# Altium schematic sheet Sheet1.SchDoc
size A4; SheetNumber: 1; SheetTotal: 1
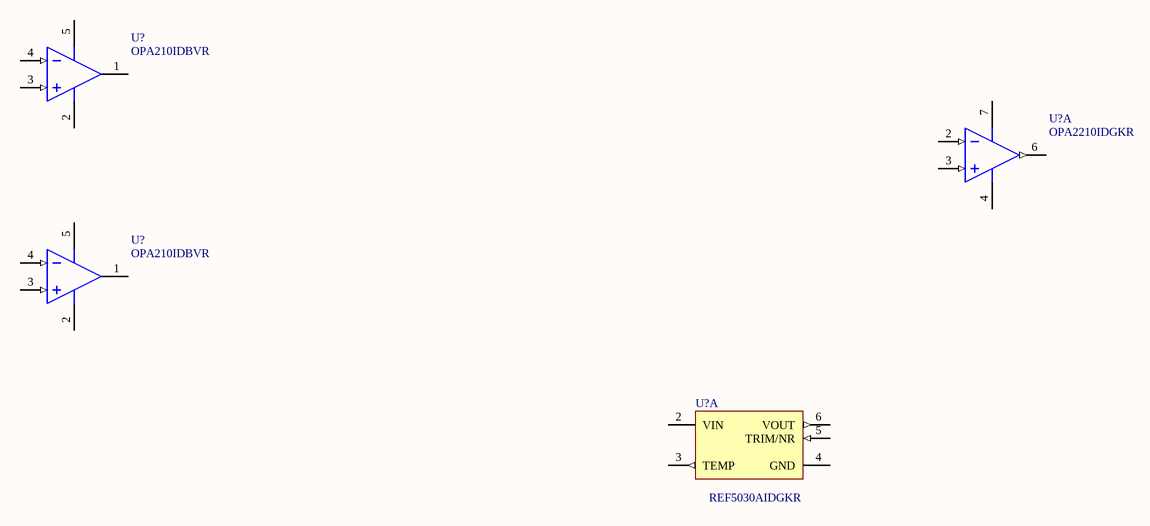
[diagram p0: Sheet1.SchDoc]

## Parts
(Parts that share a designator on the sheet are numbered #1, #2 ... from top to bottom, then left to right.)
U?#1  OPA210IDBVR  [DBV0005A_N]
U?#2  OPA2210IDGKR  [D0008A_N]  (part A of 2)
U?#3  OPA210IDBVR  [DBV0005A_N]
U?#4  REF5030AIDGKR  [DGK0008A_M]  (part A of 2)

## Nets

Not connected (* = marked no-connect by the designer): U?#1 1(OUT) 2(V-) 3(+IN) 4(–IN) 5(V+); U?#2 2(IN_A-) 3(IN_A+) 4(V-) 6(OUT_A) 7(V+); U?#3 1(OUT) 2(V-) 3(+IN) 4(–IN) 5(V+); U?#4 2(VIN) 3(TEMP) 4(GND) 5(TRIM/NR) 6(VOUT)

## Library data of the parts
U?#1 U?#3 = OPA202IDBVR: Precision, Low-Noise, Heavy Capacitive Drive, 36-V Operational Amplifiers, -40 to 105 degC, 5-Pin SOT-23 (DBV), Green (RoHS & no Sb/Br), Tape and Reel; VS Max: 36 V; Channel: 1; VS Min: 4.5 V; Slew Rate: 20 V/us; RoHS: TRUE; ComponentLink2Description: Datasheet; ComponentLink3URL: http://www.ti.com/lit/ml/mpds018l/mpds018l.pdf; Temperature Min: -40 degC; ComponentLink1Description: Manufacturer URL; ComponentLink2URL: http://www.ti.com/lit/ds/symlink/opa192.pdf; Mounting Technology: Surface Mount; PackageVersion: 4073253-4/N, 12/2014; PartNumber: OPA202IDBVR; PackageDescription: 5-Pin Plastic Small Outline, Body 1.6 x 2.9 mm, Pitch 0.95 mm; ComponentLink3Description: Package Specification; Code_JEDEC: MO-178; PackageReference: DBV0005A; Packing: Tape and Reel; ComponentLink1URL: http://www.ti.com/; DatasheetVersion: SBOS620D; Temperature Max: 125 degC
U?#2 = OPA2388IDR: Precision, Zero-Drift, Zero-Crossover, True Rail-to-Rail, Input/Output Operational Amplifiers, 2.5 to 5.5 V, -40 to 105 degC, 8-pin SOIC (D8), Green (RoHS & no Sb/Br); Manufacturer: Texas Instruments; Sub Family: High Supply Voltage Amplifier (>=30V), Low Input Bias Current Amp (<=10pA), Low Noise Amp (<=10nV/rtHz), Low Offset Voltage Amplifier (<=500uV), Precision Amplifier; Total Supply Voltage(Min)(+5V is 5, +/-5V is 10): 4.5; Offset Drift(Typ)(uV/C): 0.35; CMRR(Min)(dB): 126; IIB(Max)(pA): 10; Rating: Catalog; Packing: LARGE T&R; Slew Rate(Typ)(V/us): 20; Number of Channels: 1; Total Supply Voltage(Max)(+5V is 5, +/-5V is 10): 36; Vio (25C)(Max)(mV): 0.12; GBW(Typ)(MHz): 11; Iq per channel(Max)(mA): 2; Code_JEDEC: MS-012; PackageReference: D0008A; PartNumber: OPA2388IDR; PackageDescription: 8-Pin Plastic Small Outline, Body 4.9 x 3.9 mm, Pitch 1.27 mm; PackageVersion: 4040047-3/M, 06/2011; ComponentLink3URL: http://www.ti.com/litv/pdf/msoi002j; ComponentLink2URL: http://www.ti.com/lit/ds/symlink/opa2188.pdf; ComponentLink1Description: Manufacturer URL; DatasheetVersion: SBOS498A; Eco-Plan: Green (RoHS & no Sb/Br); ComponentLink2Description: Datasheet; ComponentLink3Description: Package Specification; ComponentLink1URL: http://www.ti.com/; Mounting Technology: Surface Mount
U?#4 = REF5030AIDGKR: Low Noise, Very Low Drift, Precision Voltage Reference, -40 to 125 degC, 8-pin MSOP (DGK), Green (RoHS & no Sb/Br); Manufacturer: Texas Instruments; Initial Accuracy @ 25/deg C(%): 0.05; Temp Coeff(Max)(ppm/ degree C): 3; SubFamily: Series Voltage Reference; Iq(Max)(uA): 1000; Rating: Catalog; VI(Min)(V): 3.2; Iout/Iz(Max)(mA): 10; VI(Max)(V): 18; Mounting Technology: Surface Mount; PartNumber: REF5030AIDGKR; ComponentLink2Description: Datasheet; DatasheetVersion: SBOS410E; ComponentLink1URL: http://www.ti.com/; ComponentLink3Description: Package Specification; Code_JEDEC: MO-187; ComponentLink1Description: Manufacturer URL; ComponentLink2URL: http://www.ti.com/general/docs/lit/getliterature.tsp?genericPartNumber=REF5030&fileType=pdf; PackageVersion: 4073329/E; VO(V): 3; Eco-Plan: Green (RoHS & no Sb/Br); ComponentLink3URL: http://www.ti.com/litv/pdf/mpds028d; PackageDescription: 8-Pin Thin Small Outline Package 3 x 3 mm Body ,0.65 mm Pitch; PackageReference: DGK0008A